# Altium schematic sheet BLOCO PRINCIPAL.SchDoc
size A3; SheetNumber: 1; SheetTotal: 7
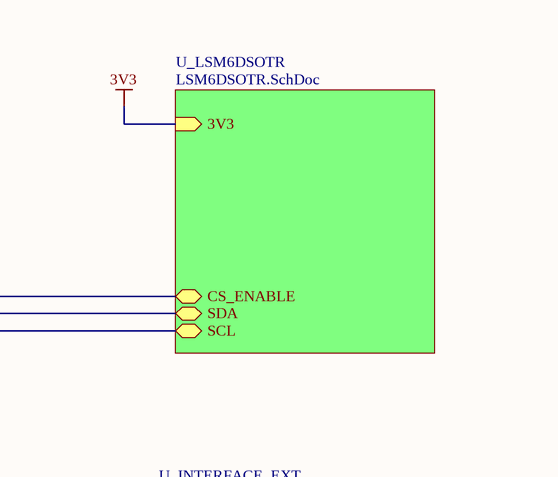
[diagram p0: BLOCO PRINCIPAL.SchDoc, top right]
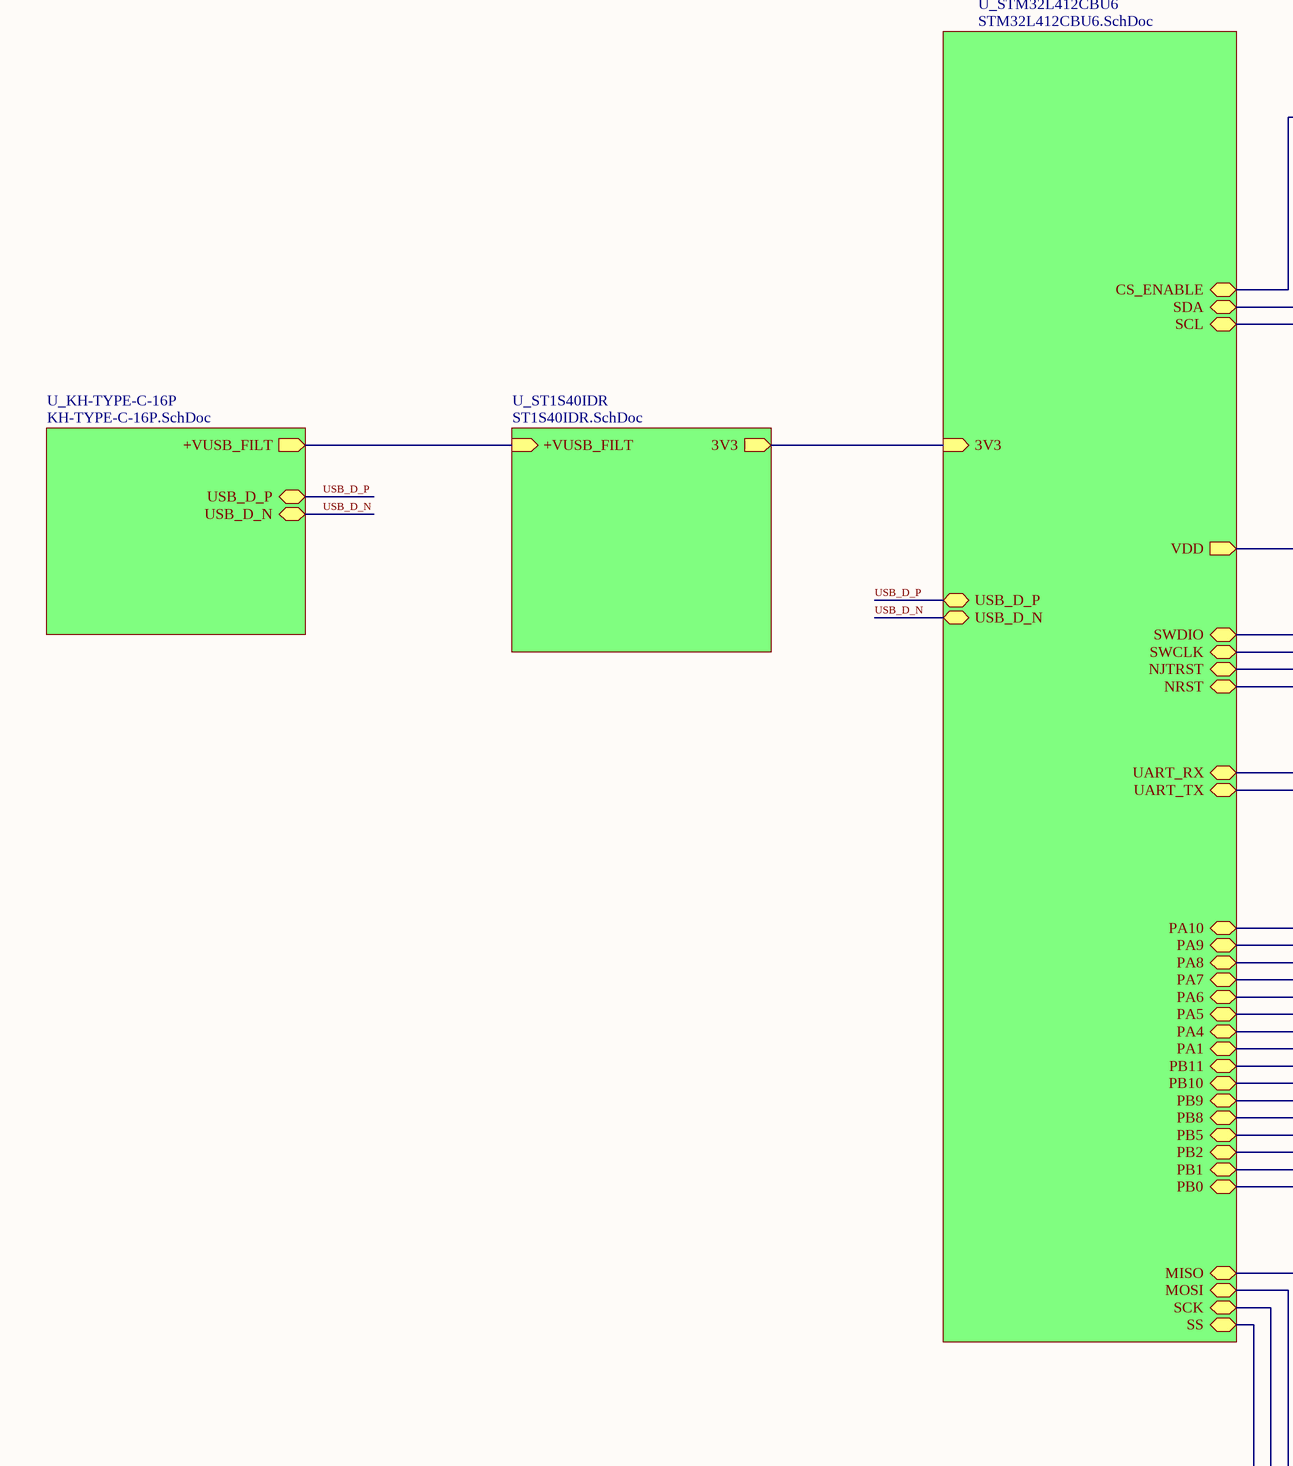
[diagram p1: BLOCO PRINCIPAL.SchDoc, bottom left]
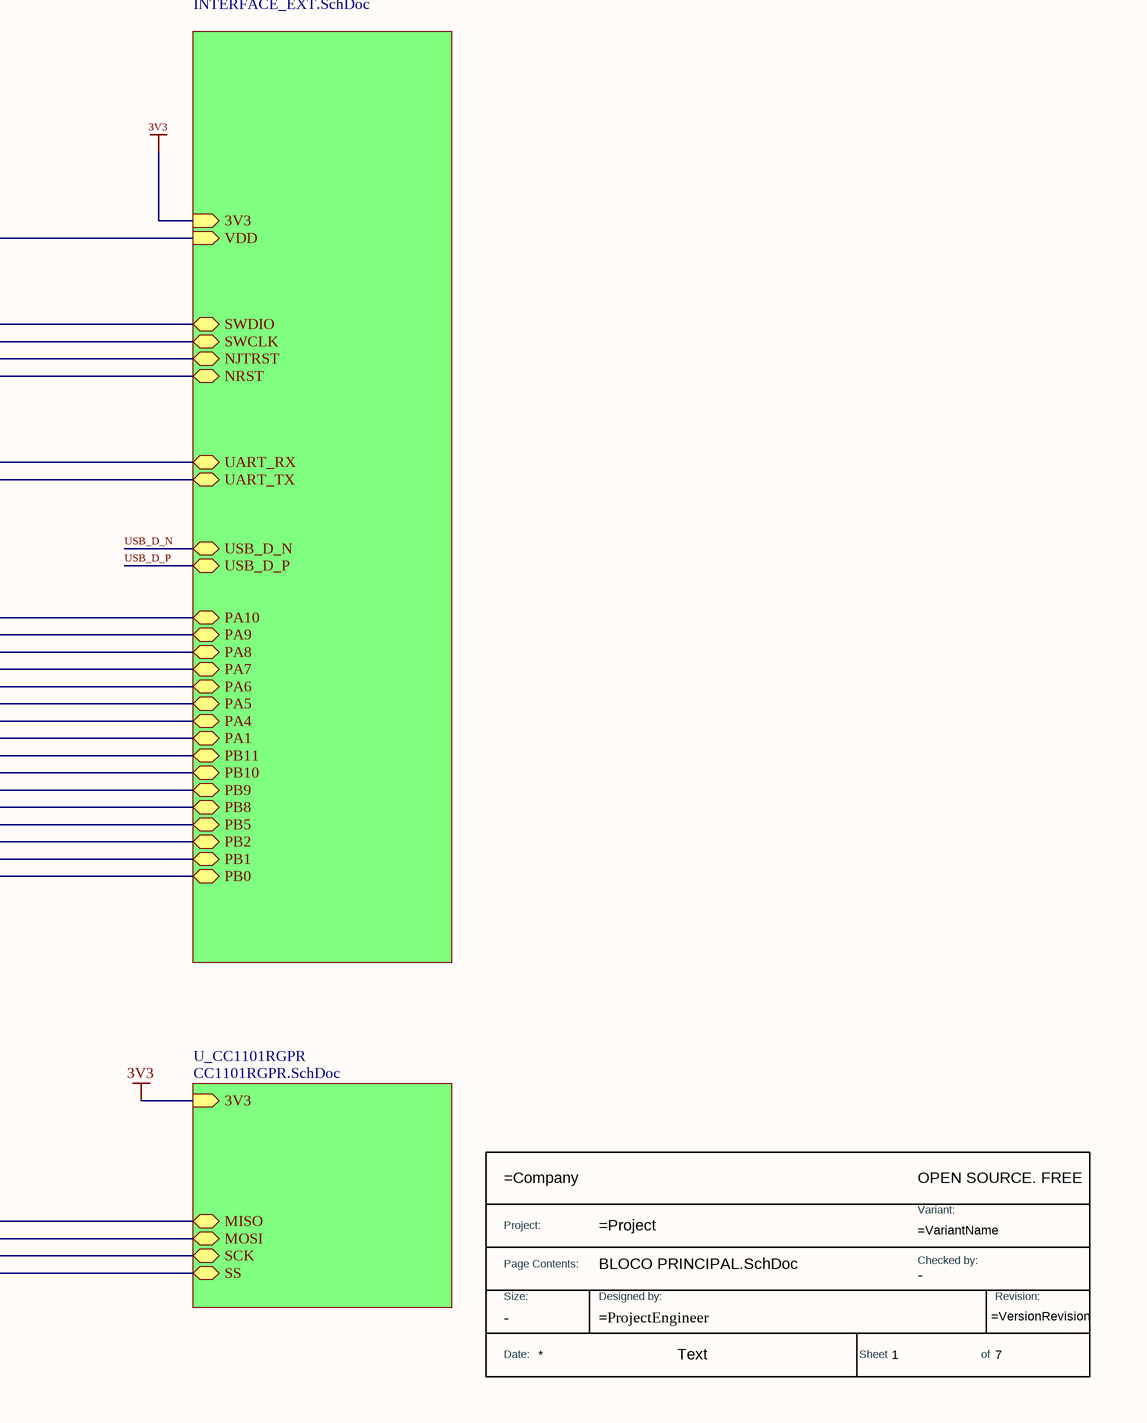
[diagram p2: BLOCO PRINCIPAL.SchDoc, bottom right]

## Parts
*  TitleBlock  (value not drawn)  (graphical)

## Sub-sheets
U_CC1101RGPR = CC1101RGPR.SchDoc: 3V3 (in), MOSI (bidir), MISO (bidir), SCK (bidir), SS (bidir)
U_INTERFACE_EXT = INTERFACE_EXT.SchDoc: SWDIO (bidir), SWCLK (bidir), NJTRST (bidir), USB_D_P (bidir), USB_D_N (bidir), VDD (in), 3V3 (in), UART_RX (bidir), UART_TX (bidir), PA10 (bidir), PA9 (bidir), PA8 (bidir), PA7 (bidir), PA6 (bidir), PA5 (bidir), PA4 (bidir), PA1 (bidir), PB11 (bidir), PB10 (bidir), PB9 (bidir), PB8 (bidir), PB5 (bidir), PB2 (bidir), PB1 (bidir), PB0 (bidir), NRST (bidir)
U_KH-TYPE-C-16P = KH-TYPE-C-16P.SchDoc: USB_D_P (bidir), USB_D_N (bidir), +VUSB_FILT (out)
U_LSM6DSOTR = LSM6DSOTR.SchDoc: SCL (bidir), SDA (bidir), 3V3 (in), CS_ENABLE (bidir)
U_ST1S40IDR = ST1S40IDR.SchDoc: 3V3 (out), +VUSB_FILT (in)
U_STM32L412CBU6 = STM32L412CBU6.SchDoc: USB_D_N (bidir), USB_D_P (bidir), 3V3 (in), MOSI (bidir), MISO (bidir), SCK (bidir), SS (bidir), SDA (bidir), SCL (bidir), VDD (out), SWDIO (bidir), SWCLK (bidir), NJTRST (bidir), PA10 (bidir), PA9 (bidir), PA8 (bidir), PA7 (bidir), PA6 (bidir), PA5 (bidir), PA4 (bidir), PA1 (bidir), PB11 (bidir), PB10 (bidir), PB9 (bidir), PB8 (bidir), PB5 (bidir), PB2 (bidir), PB1 (bidir), PB0 (bidir), UART_RX (bidir), UART_TX (bidir), NRST (bidir), CS_ENABLE (bidir)

## Nets
3V3: sheet U_CC1101RGPR/3V3, sheet U_LSM6DSOTR/3V3, sheet U_INTERFACE_EXT/3V3
USB_D_N: sheet U_KH-TYPE-C-16P/USB_D_N, sheet U_STM32L412CBU6/USB_D_N, sheet U_INTERFACE_EXT/USB_D_N
USB_D_P: sheet U_KH-TYPE-C-16P/USB_D_P, sheet U_STM32L412CBU6/USB_D_P, sheet U_INTERFACE_EXT/USB_D_P
(unnamed): sheet U_KH-TYPE-C-16P/+VUSB_FILT, sheet U_ST1S40IDR/+VUSB_FILT
(unnamed): sheet U_STM32L412CBU6/3V3, sheet U_ST1S40IDR/3V3
(unnamed): sheet U_STM32L412CBU6/MOSI, sheet U_CC1101RGPR/MOSI
(unnamed): sheet U_STM32L412CBU6/MISO, sheet U_CC1101RGPR/MISO
(unnamed): sheet U_STM32L412CBU6/SCK, sheet U_CC1101RGPR/SCK
(unnamed): sheet U_STM32L412CBU6/SS, sheet U_CC1101RGPR/SS
(unnamed): sheet U_STM32L412CBU6/SDA, sheet U_LSM6DSOTR/SDA
(unnamed): sheet U_STM32L412CBU6/SCL, sheet U_LSM6DSOTR/SCL
(unnamed): sheet U_STM32L412CBU6/VDD, sheet U_INTERFACE_EXT/VDD
(unnamed): sheet U_STM32L412CBU6/SWDIO, sheet U_INTERFACE_EXT/SWDIO
(unnamed): sheet U_STM32L412CBU6/SWCLK, sheet U_INTERFACE_EXT/SWCLK
(unnamed): sheet U_STM32L412CBU6/NJTRST, sheet U_INTERFACE_EXT/NJTRST
(unnamed): sheet U_STM32L412CBU6/PA10, sheet U_INTERFACE_EXT/PA10
(unnamed): sheet U_STM32L412CBU6/PA9, sheet U_INTERFACE_EXT/PA9
(unnamed): sheet U_STM32L412CBU6/PA8, sheet U_INTERFACE_EXT/PA8
(unnamed): sheet U_STM32L412CBU6/PA7, sheet U_INTERFACE_EXT/PA7
(unnamed): sheet U_STM32L412CBU6/PA6, sheet U_INTERFACE_EXT/PA6
(unnamed): sheet U_STM32L412CBU6/PA5, sheet U_INTERFACE_EXT/PA5
(unnamed): sheet U_STM32L412CBU6/PA4, sheet U_INTERFACE_EXT/PA4
(unnamed): sheet U_STM32L412CBU6/PA1, sheet U_INTERFACE_EXT/PA1
(unnamed): sheet U_STM32L412CBU6/PB11, sheet U_INTERFACE_EXT/PB11
(unnamed): sheet U_STM32L412CBU6/PB10, sheet U_INTERFACE_EXT/PB10
(unnamed): sheet U_STM32L412CBU6/PB9, sheet U_INTERFACE_EXT/PB9
(unnamed): sheet U_STM32L412CBU6/PB8, sheet U_INTERFACE_EXT/PB8
(unnamed): sheet U_STM32L412CBU6/PB5, sheet U_INTERFACE_EXT/PB5
(unnamed): sheet U_STM32L412CBU6/PB2, sheet U_INTERFACE_EXT/PB2
(unnamed): sheet U_STM32L412CBU6/PB1, sheet U_INTERFACE_EXT/PB1
(unnamed): sheet U_STM32L412CBU6/PB0, sheet U_INTERFACE_EXT/PB0
(unnamed): sheet U_STM32L412CBU6/UART_RX, sheet U_INTERFACE_EXT/UART_RX
(unnamed): sheet U_STM32L412CBU6/UART_TX, sheet U_INTERFACE_EXT/UART_TX
(unnamed): sheet U_STM32L412CBU6/NRST, sheet U_INTERFACE_EXT/NRST
(unnamed): sheet U_STM32L412CBU6/CS_ENABLE, sheet U_LSM6DSOTR/CS_ENABLE

## Notes on the sheet
- Todas as informações e detalhes técnicos deste documento são de inteira propriedade da empresa V2COM,
- não poderão ser copiados, reduzidos ou cedidos a terceiros sem prévia autorização por escrito da mesma.
- Salvo em (D/M/A):
- Página:
- de
- Nome do Projeto:
- https://v2com.com/
- Ed.:
- Responsável:
- Nome da página:
- Rev.:
- Projetista:
- Obs.:
- Revisor:
- Arquivo:
- -
- (in symbol TitleBlock) OPEN SOURCE. FREE; Project:; Variant:; Page Contents:; Checked by:; Size:; Designed by:; Revision:; Date:; Text; Sheet; of

## Library data of the parts
* = TitleBlock: Standard Title Block; DWG NO: =ProjectEngineer; Size: -; Checked by: -